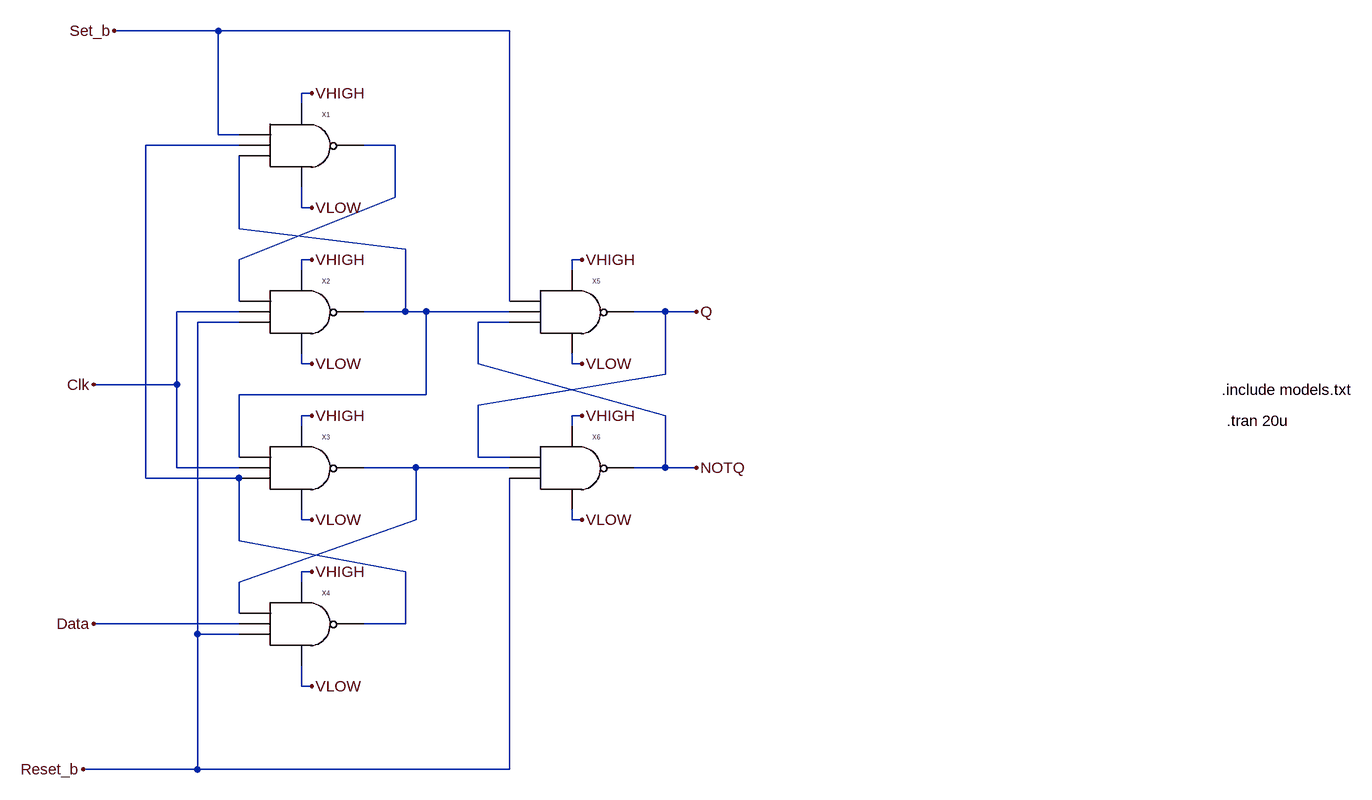
[diagram p0: schematic TI_DFF.asc]
TI_DFF.asc, the LTspice schematic file:
Version 4
SHEET 1 1752 1076
WIRE -656 -224 -816 -224
WIRE -208 -224 -656 -224
WIRE -512 -128 -528 -128
WIRE -528 -112 -528 -128
WIRE -656 -64 -656 -224
WIRE -624 -64 -656 -64
WIRE -624 -48 -768 -48
WIRE -384 -48 -432 -48
WIRE -384 32 -384 -48
WIRE -528 48 -528 16
WIRE -512 48 -528 48
WIRE -624 80 -624 -32
WIRE -368 112 -624 80
WIRE -624 128 -384 32
WIRE -512 128 -528 128
WIRE -96 128 -112 128
WIRE -528 144 -528 128
WIRE -112 144 -112 128
WIRE -624 192 -624 128
WIRE -208 192 -208 -224
WIRE -624 208 -720 208
WIRE -368 208 -368 112
WIRE -368 208 -432 208
WIRE -336 208 -368 208
WIRE -208 208 -336 208
WIRE 32 208 -16 208
WIRE 80 208 32 208
WIRE -624 224 -688 224
WIRE -208 224 -256 224
WIRE -528 288 -528 272
WIRE -512 288 -528 288
WIRE -256 288 -256 224
WIRE -112 288 -112 272
WIRE -96 288 -112 288
WIRE 32 304 32 208
WIRE -720 320 -720 208
WIRE -720 320 -848 320
WIRE -336 336 -336 208
WIRE -336 336 -624 336
WIRE -256 352 32 304
WIRE -512 368 -528 368
WIRE -96 368 -112 368
WIRE 32 368 -256 288
WIRE -528 384 -528 368
WIRE -112 384 -112 368
WIRE -624 432 -624 336
WIRE -256 432 -256 352
WIRE -208 432 -256 432
WIRE -720 448 -720 320
WIRE -624 448 -720 448
WIRE -352 448 -432 448
WIRE -208 448 -352 448
WIRE 32 448 32 368
WIRE 32 448 -16 448
WIRE 80 448 32 448
WIRE -768 464 -768 -48
WIRE -624 464 -768 464
WIRE -528 528 -528 512
WIRE -512 528 -528 528
WIRE -352 528 -352 448
WIRE -112 528 -112 512
WIRE -96 528 -112 528
WIRE -624 560 -624 464
WIRE -512 608 -528 608
WIRE -368 608 -624 560
WIRE -624 624 -352 528
WIRE -528 624 -528 608
WIRE -624 672 -624 624
WIRE -624 688 -848 688
WIRE -368 688 -368 608
WIRE -368 688 -432 688
WIRE -688 704 -688 224
WIRE -624 704 -688 704
WIRE -528 784 -528 752
WIRE -512 784 -528 784
WIRE -688 912 -688 704
WIRE -688 912 -864 912
WIRE -208 912 -208 464
WIRE -208 912 -688 912
FLAG -512 -128 VHIGH
FLAG -512 128 VHIGH
FLAG -512 368 VHIGH
FLAG -512 608 VHIGH
FLAG -96 128 VHIGH
FLAG -96 368 VHIGH
FLAG -96 288 VLOW
FLAG -96 528 VLOW
FLAG -512 784 VLOW
FLAG -512 528 VLOW
FLAG -512 288 VLOW
FLAG -512 48 VLOW
FLAG -848 320 Clk
FLAG 80 208 Q
FLAG 80 448 NOTQ
FLAG -816 -224 Set_b
FLAG -864 912 Reset_b
FLAG -848 688 Data
SYMBOL NAND -512 -48 R0
SYMATTR InstName X1
SYMBOL NAND -512 208 R0
SYMATTR InstName X2
SYMBOL NAND -512 448 R0
SYMATTR InstName X3
SYMBOL NAND -512 688 R0
SYMATTR InstName X4
SYMBOL NAND -96 208 R0
SYMATTR InstName X5
SYMBOL NAND -96 448 R0
SYMATTR InstName X6
TEXT 888 328 Left 2 !.include models.txt
TEXT 896 376 Left 2 !.tran 20u

The netlist it stands for:
* TI_DFF.asc
XX1 Set_b N001 N003 VHIGH VLOW N002 NAND  ; pins A B C VHIGH VLOW Vout
XX2 N002 Clk Reset_b VHIGH VLOW N003 NAND  ; pins A B C VHIGH VLOW Vout
XX3 N003 Clk N001 VHIGH VLOW N004 NAND  ; pins A B C VHIGH VLOW Vout
XX4 N004 Data Reset_b VHIGH VLOW N001 NAND  ; pins A B C VHIGH VLOW Vout
XX5 Set_b N003 NOTQ VHIGH VLOW Q NAND  ; pins A B C VHIGH VLOW Vout
XX6 Q N004 Reset_b VHIGH VLOW NOTQ NAND  ; pins A B C VHIGH VLOW Vout
.include models.txt
.tran 20u
.backanno
.end